# EAGLE design appleii (EAGLE 9.6.1)
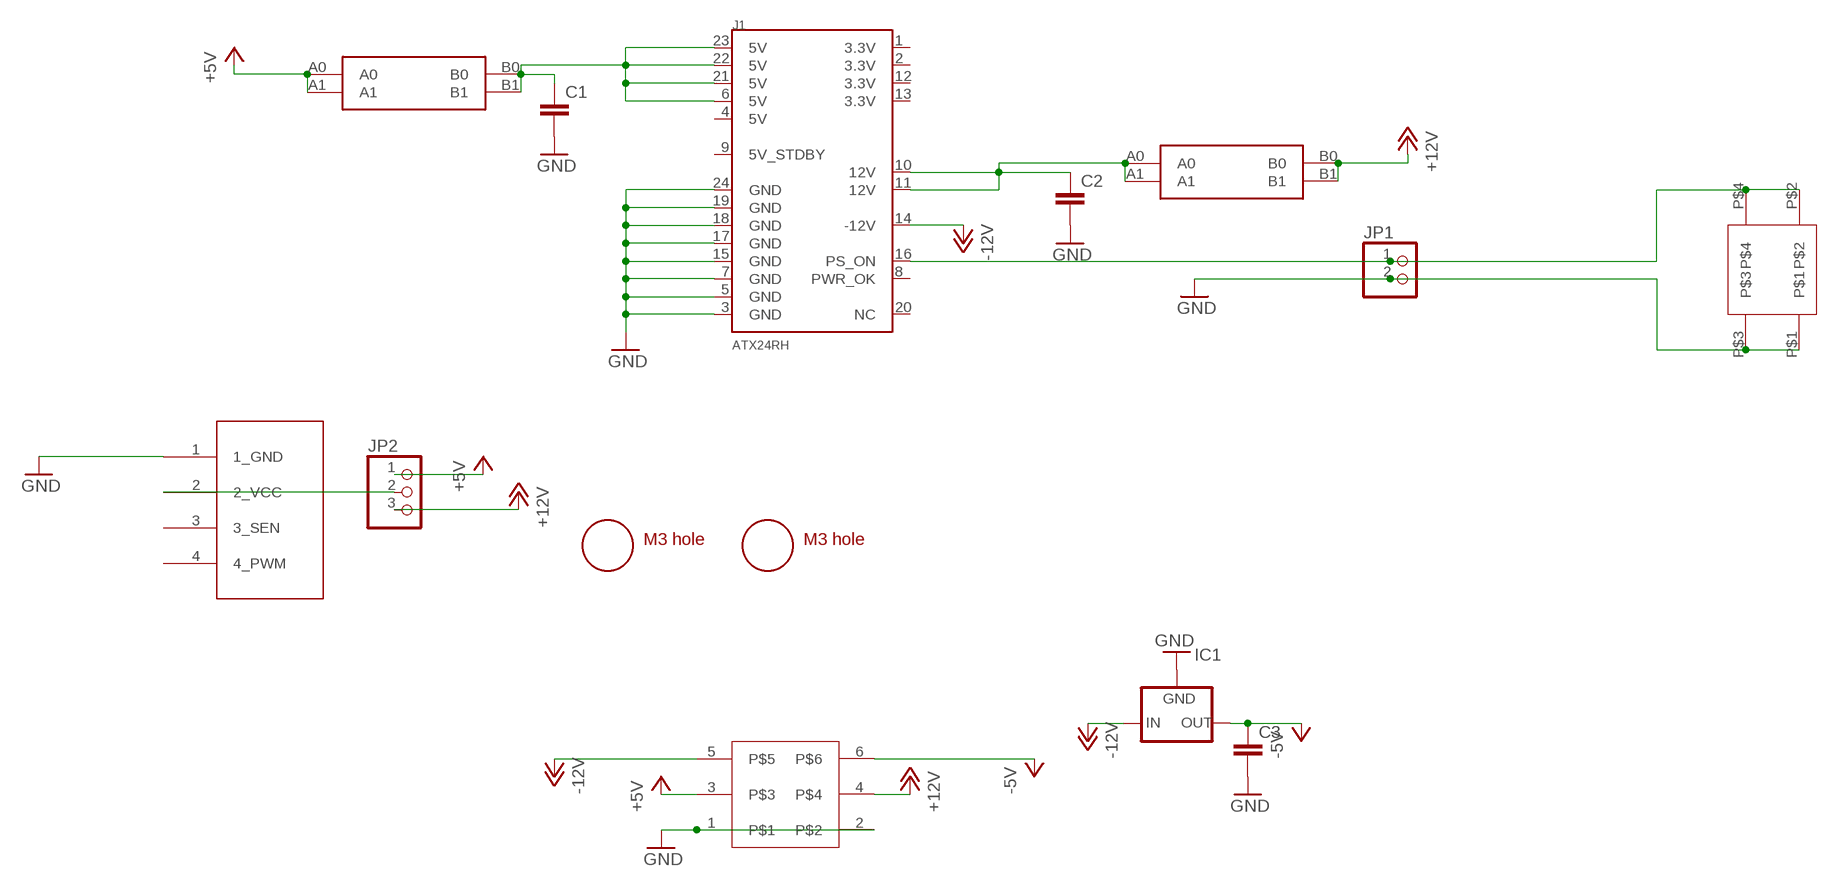
[diagram p0: schematic, sheet 1]

## Parts
C1  C5/2.5  [C5B2.5]
C2  C5/2.5  [C5B2.5]
C3  C5/2.5  [C5B2.5]
IC1  79XXS  [79XXS]
J1  ATX24RH  [ATX24_RIGHT_ANGLE]
JP1  PINHD-1X2  [1X02]
JP2  PINHD-1X3  [1X03]
JP3  4PIN_FAN  [1X04]
U$1  CAR_FUSE_HOLDER3IN1  [FUSE_HOLDER_3IN1]
U$2  CAR_FUSE_HOLDER3IN1  [FUSE_HOLDER_3IN1]
U$3  ROCK_SW  [ROCK_SWITCH]
U$4  M3_MOUNTING_HOLE  [M3_MOUNTING_HOLE_PACK]
U$5  M3_MOUNTING_HOLE  [M3_MOUNTING_HOLE_PACK]
U$6  APPLEII  [APPLEII]

## Nets
+5V: JP2.1 U$1.A0 U$1.A1 U$6.3
+12V: JP2.3 U$2.B0 U$2.B1 U$6.4
-5V: C3.1 IC1.OUT U$6.6
-12V: IC1.IN J1.14(-12V) U$6.5
GND: C1.2 C2.2 C3.2 IC1.GND J1.3(GND) J1.5(GND) J1.7(GND) J1.15(GND) J1.17(GND) J1.18(GND) J1.19(GND) J1.24(GND) JP1.2 JP3.1(1_GND) U$3.P$1 U$3.P$3 U$6.1 U$6.2
N$1: JP2.2 JP3.2(2_VCC)
N$5: J1.16(PS_ON) JP1.1 U$3.P$2 U$3.P$4
N$6: C1.1 J1.6(5V) J1.21(5V) J1.22(5V) J1.23(5V) U$1.B0 U$1.B1
N$8: C2.1 J1.10(12V) J1.11(12V) U$2.A0 U$2.A1
Unconnected: J1.1(3.3V) J1.2(3.3V) J1.4(5V) J1.8(PWR_OK) J1.9(5V_STDBY) J1.12(3.3V) J1.13(3.3V) J1.20(NC) JP3.3(3_SEN) JP3.4(4_PWM)

## Library data of the parts
C1-C3 = capacitor-wima:C: CAPACITOR naming: grid - package width
IC1 = v-reg:79XXS: VOLTAGE REGULATOR
J1 = macse:ATX24: ATX24 Pin Power Supply Connector This is a good connector for connecting a computer power supply to a PCB. It's massive, but provides many amps of power at 5V and 12V. SKU: PRT-09498
JP1 = pinhead:PINHD-1X2: PIN HEADER
JP2 = pinhead:PINHD-1X3: PIN HEADER
JP3 = appleii:4PIN_FAN: PIN HEADER
U$1 U$2 = atx_power_control:CAR_FUSE_HOLDER
U$3 = atx4vc:ROCK_SW
U$4 U$5 = a:M3_MOUNTING_HOLE
U$6 = atx4vc:APPLEII

## Board
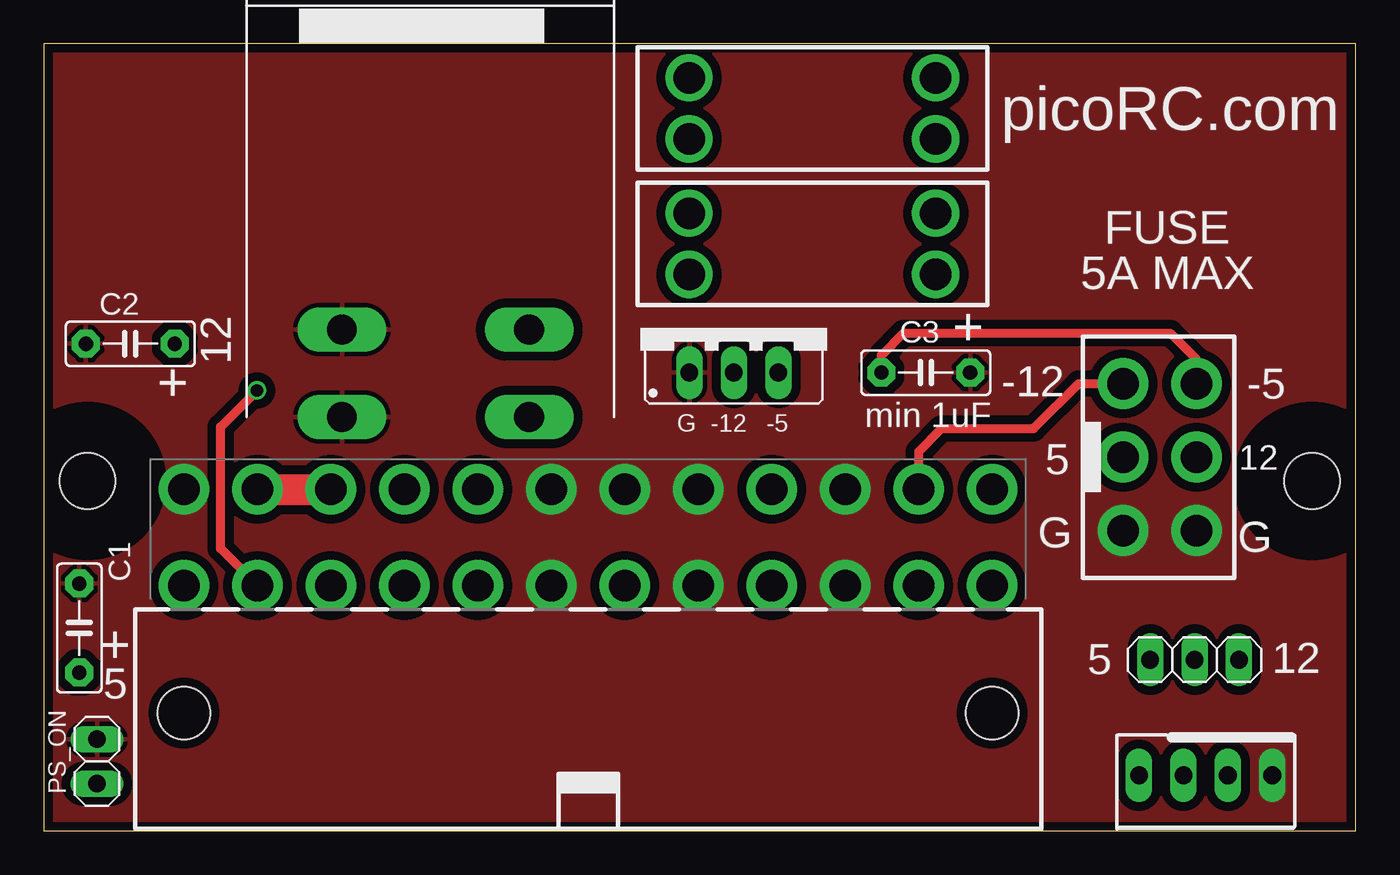
[diagram p1: board, top side]
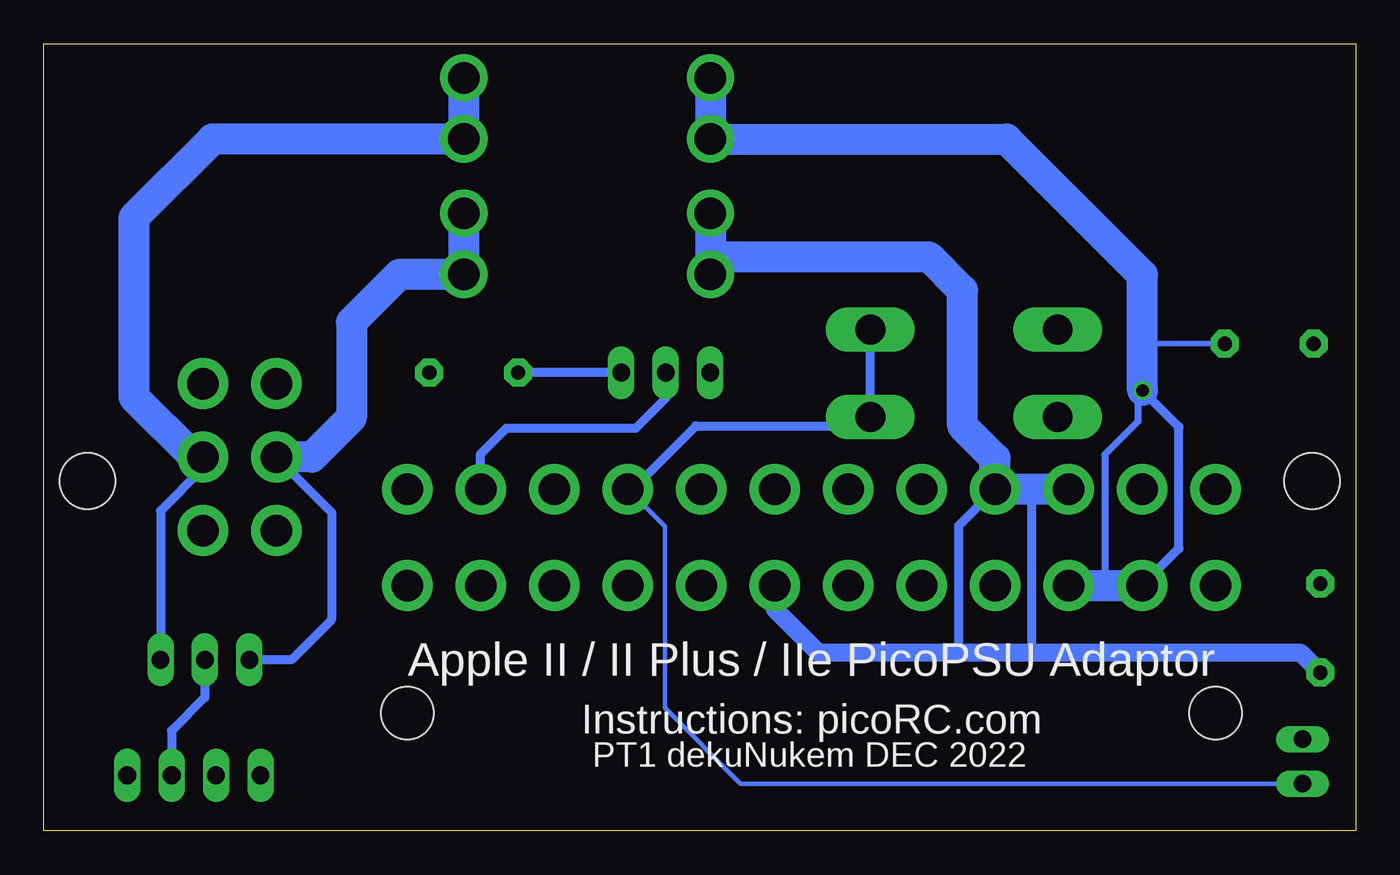
[diagram p2: board, bottom side, seen from below]

Size 75 x 45 mm. Coordinates in mm from the lower left corner, seen from the top.
Outline: 75,45 0,45 0,0 75,0 75,45
Copper layers (1*16): Top 0.035mm / dielectric 1.5mm / Bottom 0.035mm
Design rules "deku_2layer_6mil *": minimum track width 6mil, minimum drill 15mil, track to track 20mil, track to pad 6mil, pad to pad 6mil, via to via 6mil, smd to smd 6mil, copper to edge 10mil, drill to drill 6mil, minimum pad ring 7mil, minimum via ring 7mil, stop-mask expansion 4mil, vias tented up to drill 25mil, thermal gap 10mil
tRestrict: area -1.5,16 to 6.5,24; area 68.5,16 to 76.5,24

### Footprints (pad centres in the part's own frame; a part is rotated, then mirrored left to right if it is on the bottom)
C5B2.5 = drill 0.813 pad 1.6 octagon: 1 -2.54,0; 2 2.54,0
79XXS = drill 1.016 long: GND -2.54,-2.54; IN 0,-2.54; OUT 2.54,-2.54
ATX24_RIGHT_ANGLE = drill 1.8 pad 2.9: 1 23.1,4.76; 2 18.9,4.76; 3 14.7,4.76; 4 10.5,4.76; 5 6.3,4.76; 6 2.1,4.76; 7 -2.1,4.76; 8 -6.3,4.76; 9 -10.5,4.76; 10 -14.7,4.76; 11 -18.9,4.76; 12 -23.1,4.76; 13 23.1,10.26; 14 18.9,10.26; 15 14.7,10.26; 16 10.5,10.26; 17 6.3,10.26; 18 2.1,10.26; 19 -2.1,10.26; 20 -6.3,10.26; 21 -10.5,10.26; 22 -14.7,10.26; 23 -18.9,10.26; 24 -23.1,10.26 | hole 3: -23.1,-2.54; 23.1,-2.54
1X02 = drill 1.016 long: 1 -1.27,0; 2 1.27,0
1X03 = drill 1.016 long: 1 -2.54,0; 2 0,0; 3 2.54,0
1X04 = drill 1.016 long: 1 -3.81,0; 2 -1.27,0; 3 1.27,0; 4 3.81,0
FUSE_HOLDER_3IN1 = drill 1.8: A0 -7.05,1.75; A1 -7.05,-1.75; B0 7.05,1.75; B1 7.05,-1.75
ROCK_SWITCH = drill 1.7 long: P$1 -5.05,0; P$2 5.65,0; P$3 -5.05,5; P$4 5.65,5
M3_MOUNTING_HOLE_PACK = hole 3.2: 0,0
APPLEII = drill 1.8 pad 2.9: 1 4.2,-2.05; 2 4.2,2.15; 3 0,-2.05; 4 0,2.15; 5 -4.2,-2.05; 6 -4.2,2.15

### Placement (x,y rotation side)
C1  2.03,11.59 90 top
C2  4.95,27.84 180 top
C3  50.42,26.19 0 top
IC1  39.45,28.73 0 top
J1  31.11,9.26 0 top
JP1  3.05,3.97 90 top
JP2  65.79,9.78 0 top
JP3  66.42,3.17 180 top
U$1  43.94,33.56 180 top
U$2  43.94,41.31 0 top
U$3  22.1,23.66 0 top
U$4  72.5,20 0 top
U$5  2.5,20 0 top
U$6  63.75,21.37 270 top

### Tracks (layer width: path | path; a pad name or v marks a point on that pad's centre or on a via)
+5V
  Bottom 0.508: U$6.3 58.55,18.21 58.55,12.06 60.83,9.78 JP2.1
  Bottom 1.778: U$1.A1 U$1.A0 54.68,31.81 57.4,29.08 57.4,23.62 59.66,21.37 U$6.3
+12V
  Bottom 0.508: U$6.4 65.9,20.71 68.33,18.29 JP2.3
  Bottom 1.778: U$2.B0 U$2.B1 65.34,39.56 69.85,35.05 69.85,24.81 66.41,21.37 U$6.4
-5V
  Top 0.508: C3.1 47.88,27.18 49.15,28.45 64.39,28.45 65.9,26.93 U$6.6
  Bottom 0.508: IC1.OUT C3.1
-12V
  Top 0.508: J1.14 50.02,21.68 51.32,22.99 56.58,22.99 59.16,25.57 U$6.5
  Bottom 0.508: J1.14 50.02,21.55 48.55,23.02 41.15,23.02 39.45,24.72 IC1.IN
GND
  pour Top (isolate 0.508): 75,45 0,45 0,-0.06 75,-0.06
N$1
  Bottom 0.508: JP2.2 65.79,7.62 67.69,5.71 JP3.2
N$5
  Bottom 0.254: J1.16 39.5,17.41 39.5,7.02 35.18,2.7 JP1.1
  Bottom 0.508: J1.16 41.34,19.52 37.72,23.15 28.26,23.15 U$3.P$2 U$3.P$4
N$6
  Top 1.778: J1.23 J1.22
  Bottom 0.508: J1.21 22.71,17.43 22.71,10.19 | 18.52,10.19 18.52,19.52
  Bottom 1.016: J1.6 33.22,12.67 30.73,10.19 22.71,10.19 18.52,10.19 3.17,10.19 C1.1
  Bottom 1.778: J1.22 18.52,19.52 J1.21 20.61,21.29 22.48,23.16 22.48,30.89 24.41,32.83 35.88,32.83 U$1.B0 U$1.B1
N$8  (via drill 0.7)
  Top 0.508: J1.11 10.11,16.13 10.11,23.09 v12.19,25.18
  Bottom 0.305: C2.1 12.19,27.84
  Bottom 0.406: v12.19,25.18 12.45,24.92 12.45,23.41 14.35,21.5 14.35,14.02
  Bottom 0.508: J1.11 10.11,16.13 10.11,23.09 v12.19,25.18
  Bottom 1.778: J1.10 14.35,14.02 J1.11 | v12.19,25.18 12.19,27.84 12.19,31.78 19.97,39.56 U$2.A1 U$2.A0

### Text on the board
tNames: picoRC.com | + | FUSE / 5A MAX | + | 12 | + | -12 | -5 | min 1uF | G | -12 | -5 | 5 | 12 | G | G | + | 5 | 12 | 5 | PS_ON
bNames: Apple II / II Plus / IIe PicoPSU Adaptor | Instructions: picoRC.com | PT1 dekuNukem DEC 2022